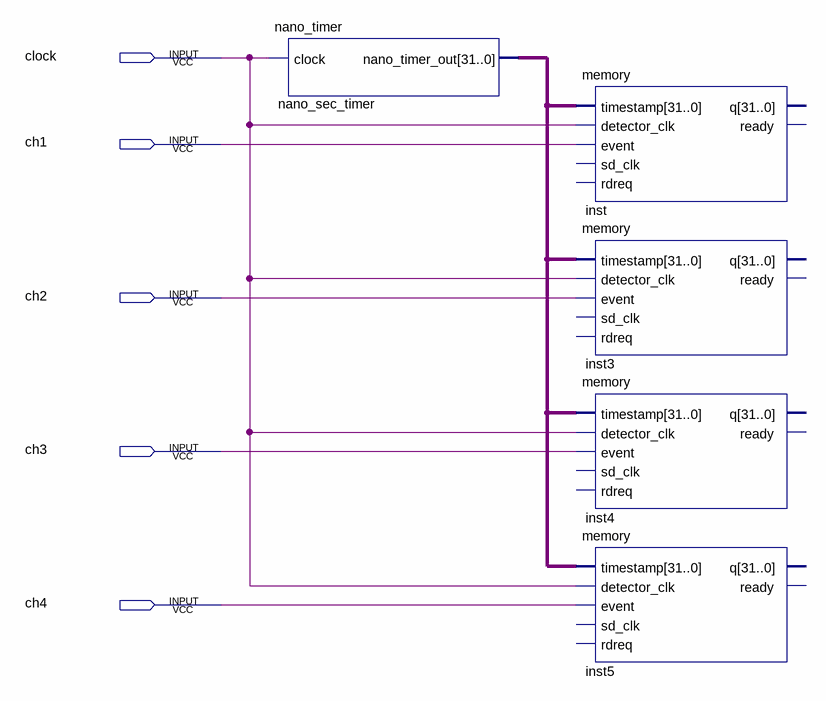
[diagram p0: schematic sheet]
// Quartus schematic scint_reader_top.bdf as structural Verilog: 5 symbols, 5 pins
module scint_reader_top (
  input  clock,
  input  ch1,
  input  ch2,
  input  ch3,
  input  ch4
);

  wire [31:0] nano_sec_timer_nano_timer_out;

  nano_timer nano_sec_timer (.clock(clock), .nano_timer_out(nano_sec_timer_nano_timer_out));
  memory inst (
    .timestamp(nano_sec_timer_nano_timer_out), .detector_clk(clock), .\event (ch1));  // open: sd_clk, rdreq, q, ready
  memory inst3 (
    .timestamp(nano_sec_timer_nano_timer_out), .detector_clk(clock), .\event (ch2));  // open: sd_clk, rdreq, q, ready
  memory inst4 (
    .timestamp(nano_sec_timer_nano_timer_out), .detector_clk(clock), .\event (ch3));  // open: sd_clk, rdreq, q, ready
  memory inst5 (
    .timestamp(nano_sec_timer_nano_timer_out), .detector_clk(clock), .\event (ch4));  // open: sd_clk, rdreq, q, ready
endmodule
